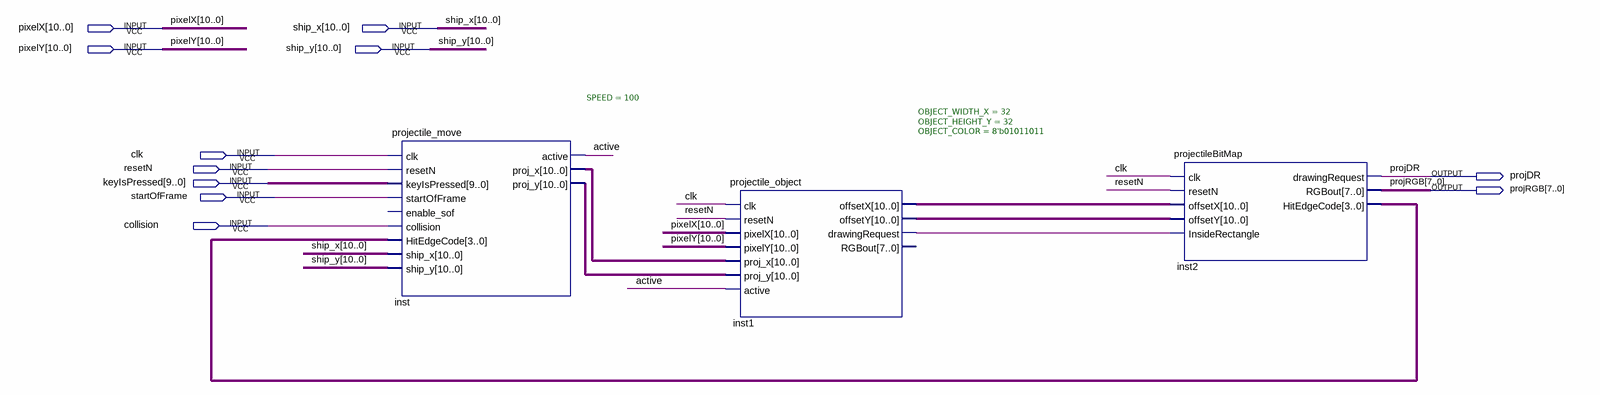
[diagram p0: schematic sheet]
// Quartus schematic projectile_Block_T.bdf as structural Verilog: 3 symbols, 11 pins
module projectile_Block_T (
  input  [10:0] pixelX,
  input  [10:0] ship_x,
  input  [10:0] pixelY,
  input  [10:0] ship_y,
  input  clk,
  input  resetN,
  input  [9:0] keyIsPressed,
  input  startOfFrame,
  input  collision,
  output projDR,
  output [7:0] projRGB
);

  wire active, inst1_drawingrequest;
  wire [3:0] inst2_hitedgecode;
  wire [10:0] inst1_offsetx, inst1_offsety, inst_proj_x, inst_proj_y;

  projectile_move #(.SPEED(100)) inst (
    .clk(clk), .resetN(resetN), .keyIsPressed(keyIsPressed), .startOfFrame(startOfFrame),
    .collision(collision), .HitEdgeCode(inst2_hitedgecode), .ship_x(ship_x), .ship_y(ship_y),
    .active(active), .proj_x(inst_proj_x), .proj_y(inst_proj_y));  // open: enable_sof
  projectile_object #(.OBJECT_WIDTH_X(32), .OBJECT_HEIGHT_Y(32), .OBJECT_COLOR(8'b01011011)) inst1 (
    .clk(clk), .resetN(resetN), .pixelX(pixelX), .pixelY(pixelY), .proj_x(inst_proj_x), .proj_y(inst_proj_y),
    .active(active), .offsetX(inst1_offsetx), .offsetY(inst1_offsety), .drawingRequest(inst1_drawingrequest));  // open: RGBout
  projectileBitMap inst2 (
    .clk(clk), .resetN(resetN), .offsetX(inst1_offsetx), .offsetY(inst1_offsety),
    .InsideRectangle(inst1_drawingrequest), .drawingRequest(projDR), .RGBout(projRGB),
    .HitEdgeCode(inst2_hitedgecode));
endmodule
